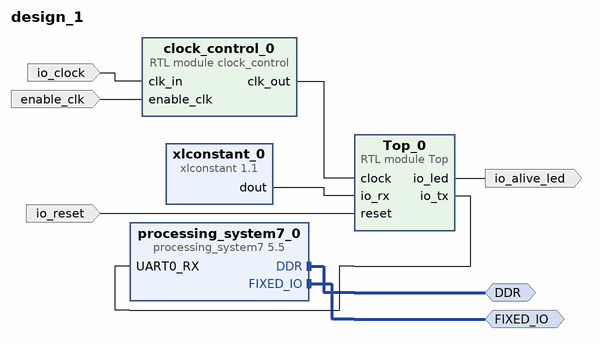
[diagram p0: block diagram of the top level]
# Vivado block design design_1, xc7z010clg400-1, Vivado 2020.1
create_bd_design design_1

create_bd_intf_port -mode Master -vlnv xilinx.com:interface:ddrx_rtl:1.0 DDR
create_bd_intf_port -mode Master -vlnv xilinx.com:display_processing_system7:fixedio_rtl:1.0 FIXED_IO
create_bd_port -dir I -type clk io_clock
set_property -dict {CONFIG.FREQ_HZ 100000000} [get_bd_ports io_clock]
create_bd_port -dir O io_alive_led
create_bd_port -dir I io_reset
create_bd_port -dir I -type clk enable_clk

create_bd_cell -type ip -vlnv xilinx.com:ip:processing_system7:5.5 processing_system7_0
set_property -dict [list \
  CONFIG.PCW_UART0_PERIPHERAL_ENABLE 1 \
  CONFIG.PCW_UART0_UART0_IO EMIO \
  CONFIG.PCW_UART1_PERIPHERAL_ENABLE 1 \
  CONFIG.PCW_UART1_UART1_IO {MIO 48 .. 49} \
  CONFIG.PCW_UART_PERIPHERAL_FREQMHZ 100 \
  CONFIG.PCW_USE_M_AXI_GP0 0 \
] [get_bd_cells processing_system7_0]
# 44 more settings of processing_system7_0 are not shown: defaults, MIO pin electricals, DDR timing, and values the tool derives
create_bd_cell -type module -reference clock_control clock_control_0
create_bd_cell -type ip -vlnv xilinx.com:ip:xlconstant:1.1 xlconstant_0
create_bd_cell -type module -reference Top Top_0

# ---- connections ----

connect_bd_intf_net [get_bd_intf_ports FIXED_IO] [get_bd_intf_pins processing_system7_0/FIXED_IO]
connect_bd_intf_net [get_bd_intf_ports DDR] [get_bd_intf_pins processing_system7_0/DDR]
connect_bd_net [get_bd_pins Top_0/io_tx] [get_bd_pins processing_system7_0/UART0_RX]
connect_bd_net [get_bd_pins Top_0/io_led] [get_bd_ports io_alive_led]
connect_bd_net [get_bd_ports io_reset] [get_bd_pins Top_0/reset]
connect_bd_net [get_bd_ports io_clock] [get_bd_pins clock_control_0/clk_in]
connect_bd_net -net enable_clk_0_1 [get_bd_ports enable_clk] [get_bd_pins clock_control_0/enable_clk]
connect_bd_net [get_bd_pins clock_control_0/clk_out] [get_bd_pins Top_0/clock]
connect_bd_net [get_bd_pins xlconstant_0/dout] [get_bd_pins Top_0/io_rx]

validate_bd_design
save_bd_design
